# EAGLE design Battlebot_OSMC5 (EAGLE 5.06)
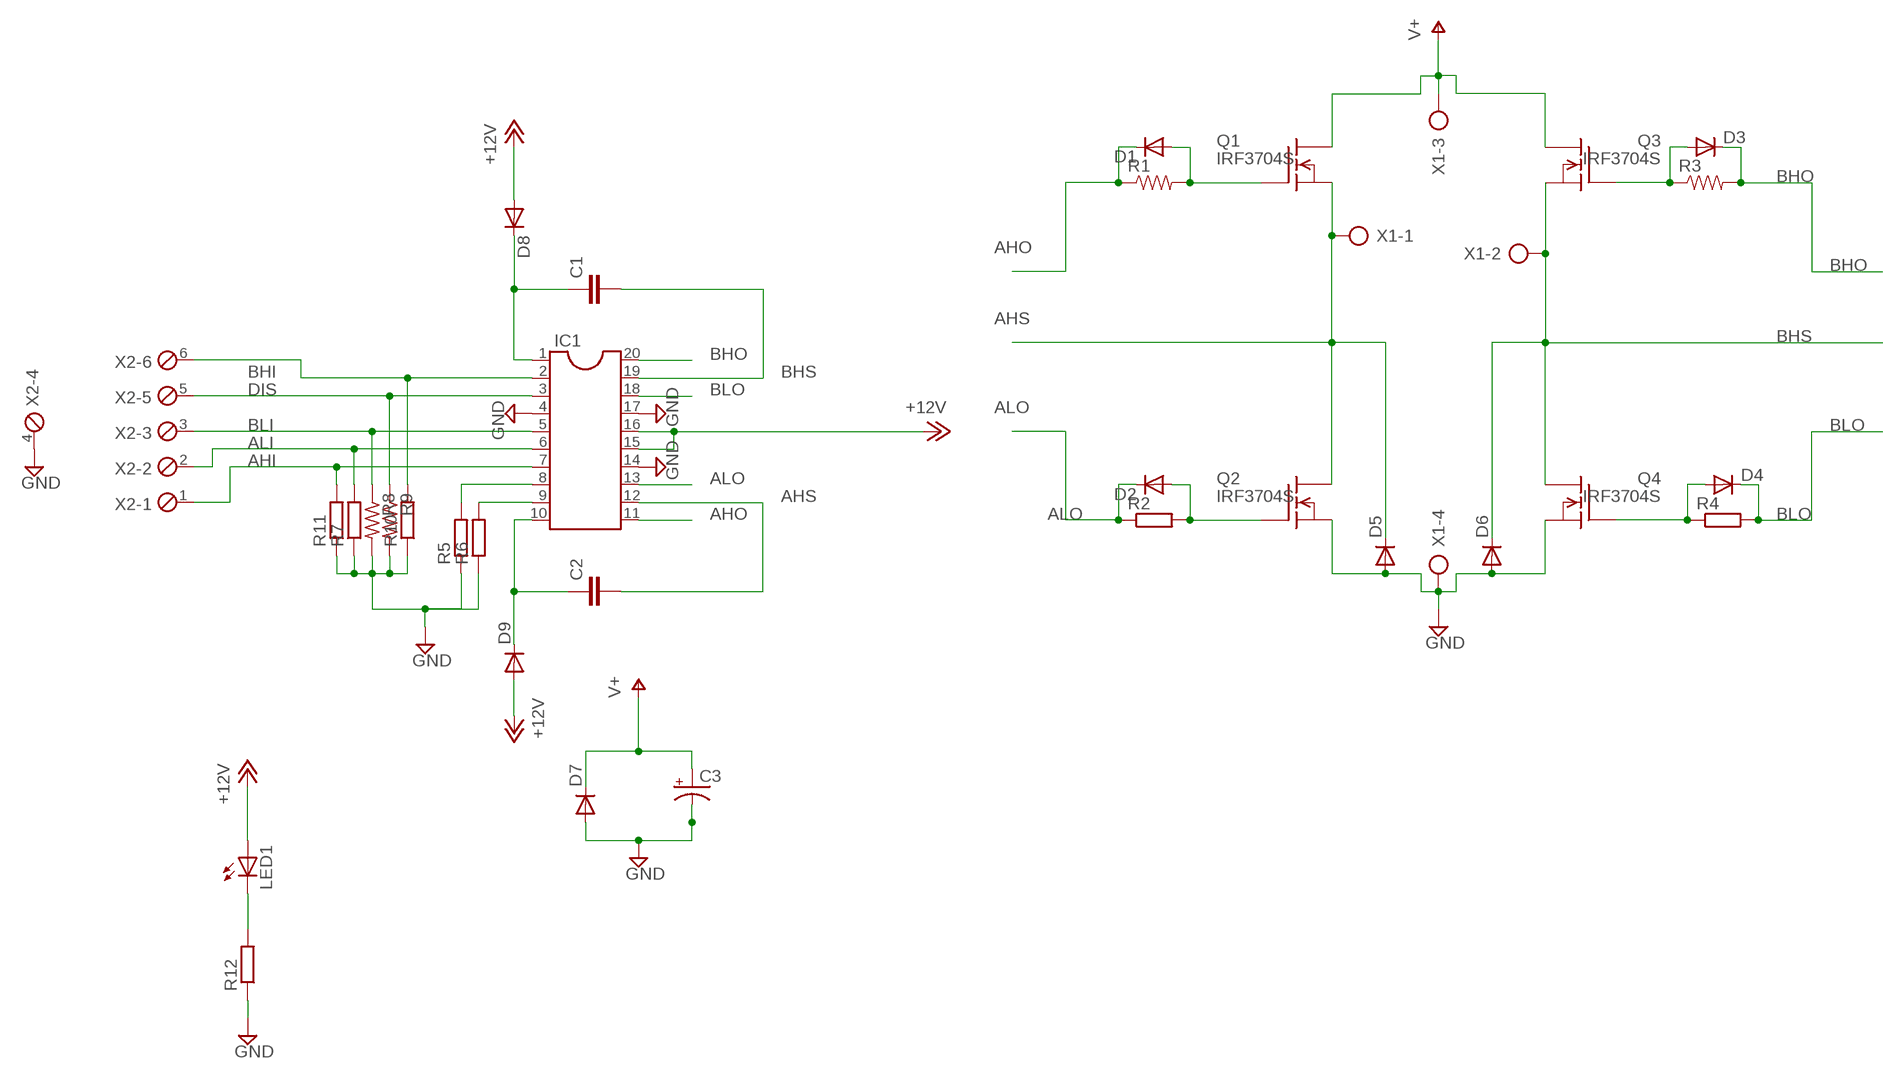
[diagram p0: schematic, sheet 1]

## Parts
C1  C7.5/3  [C7.5B3]
C2  C7.5/3  [C7.5B3]
C3  CPOL-USE5-10.5  [E5-10,5]
D1  DIODE1N4148  [DIODE-1N4148]
D2  DIODE-D-5  [D-5]
D3  DIODE1N4148  [DIODE-1N4148]
D4  DIODE-D-5  [D-5]
D5  DIODE-C1702-05  [C1702-05]
D6  DIODE-C1702-05  [C1702-05]
D7  DIODE-C1702-05  [C1702-05]
D8  1N4148DO35-7  [DO35-7]
D9  1N4148DO35-7  [DO35-7]
IC1  DIL20  [DIL20]
LED1  LED3MM  [LED3MM]
Q1  IRF3704S  BUZ325V  [TO218V]
Q2  IRF3704S  BUZ325V  [TO218V]
Q3  IRF3704S  BUZ325V  [TO218V]
Q4  IRF3704S  BUZ325V  [TO218V]
R1  RESISTORPTH1  [AXIAL-0.3]
R2  R-EU_0204/5  [0204/5]
R3  RESISTORPTH1  [AXIAL-0.3]
R4  R-EU_0204/5  [0204/5]
R5  R-EU_0204/5  [0204/5]
R6  R-EU_0204/5  [0204/5]
R7  R-EU_0204/5  [0204/5]
R8  R-US_0204/2V  [0204V]
R9  R-US_0204/2V  [0204V]
R10  R-EU_0204/5  [0204/5]
R11  R-EU_0204/5  [0204/5]
R12  R-EU_0204/5  [0204/5]
X1  AK500/4  [AK500/4]
X2  MPT6  [6POL254]

## Nets
+12V: D8.A D9.A IC1.15 IC1.16 LED1.A
AHI: IC1.7 R11.2 X2.1
AHO: D1.C IC1.11 R1.P$1
AHS: C2.2 D5.C IC1.12 Q1.3(S) Q2.2(D) X1.1
ALI: IC1.6 R7.2 X2.2
ALO: D2.C IC1.13 R2.1
BHI: IC1.2 R10.2 X2.6
BHO: D3.C IC1.20 R3.P$2
BHS: C1.2 D6.C IC1.19 Q3.3(S) Q4.2(D) X1.2
BLI: IC1.5 R8.1 X2.3
BLO: D4.C IC1.18 R4.2
DIS: IC1.3 R9.1 X2.5
GND: C3.- D5.A D6.A D7.A IC1.4 IC1.14 IC1.17 Q2.3(S) Q4.3(S) R5.1 R6.1 R7.1 R8.2 R9.2 R10.1 R11.1 R12.1 X1.4 X2.4
N$1: C2.1 D9.C IC1.10
N$2: C1.1 D8.C IC1.1
N$5: D1.A Q1.1(G) R1.P$2
N$6: D2.A Q2.1(G) R2.2
N$7: D4.A Q4.1(G) R4.1
N$8: D3.A Q3.1(G) R3.P$1
N$11: LED1.K(C) R12.2
N$14: IC1.8 R5.2
N$15: IC1.9 R6.2
V+: C3.+ D7.C Q1.2(D) Q3.2(D) X1.3

## Library data of the parts
C1 C2 = capacitor-wima:C: CAPACITOR naming: grid - package width
C3 = rcl:CPOL-US: POLARIZED CAPACITOR, American symbol
D1 D3 = SparkFun:DIODE: Diode These are standard reverse protection diodes and small signal diodes. SMA package can handle up to about 1A. SOD-323 can handle about 200mA. What the SOD-323 package when ordering, there are some mfgs out there that are 5-pin packages.
D2 D4-D7 = diode:DIODE-: DIODE
D8 D9 = diode:1N4148: DIODE high speed (Philips)
IC1 = ic-package:DIL20: Dual In Line / Socket
LED1 = SparkFun:LED: LEDs Standard schematic elements and footprints for 5mm, 3mm, 1206, and 0603 sized LEDs. 5mm - Spark Fun Electronics SKU : COM-00529 (and others)
Q1-Q4 = transistor-fet:BUZ325: N-Channel Enhancement MOSFET 400V; 10,5A; 0,5Ohm
R1 R3 = SparkFun:RESISTOR: Resistor Basic schematic elements and footprints for 0603, 1206, and PTH 1/10th watt (small) resistors.
R2 R4-R7 R10-R12 = rcl:R-EU_: RESISTOR, European symbol
R8 R9 = rcl:R-US_: RESISTOR, American symbol
X1 = con-ptr500:AK500/4: CONNECTOR
X2 = con-phoenix-254:MPT6: PHOENIX CONNECTOR

## Board
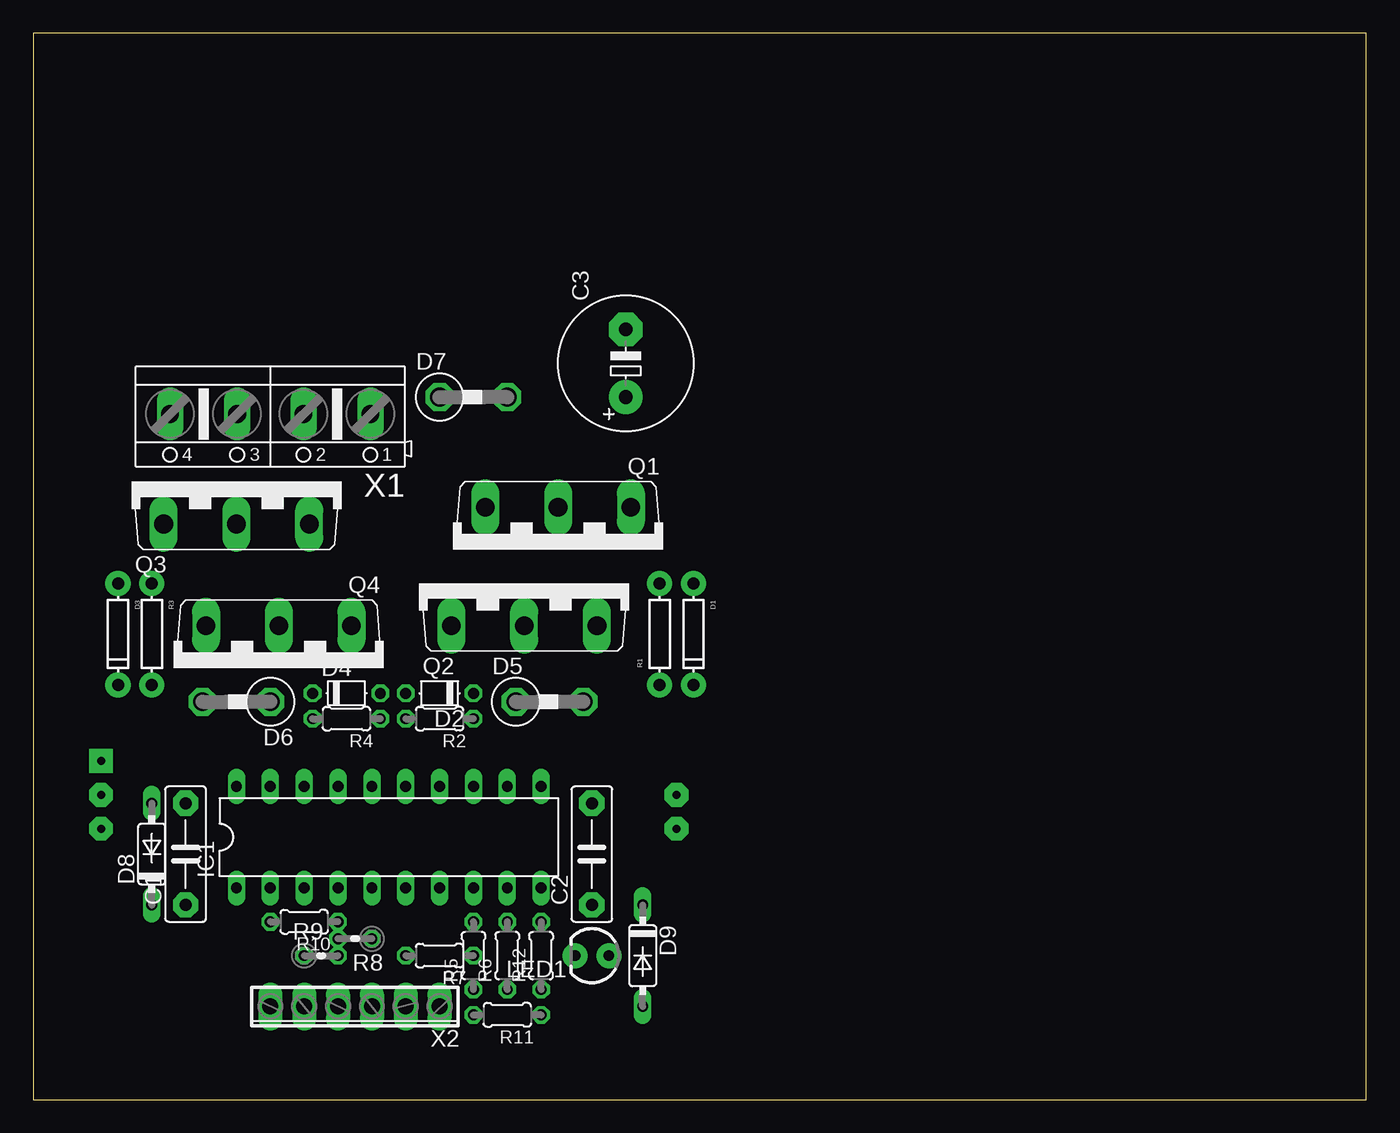
[diagram p1: board, top side]
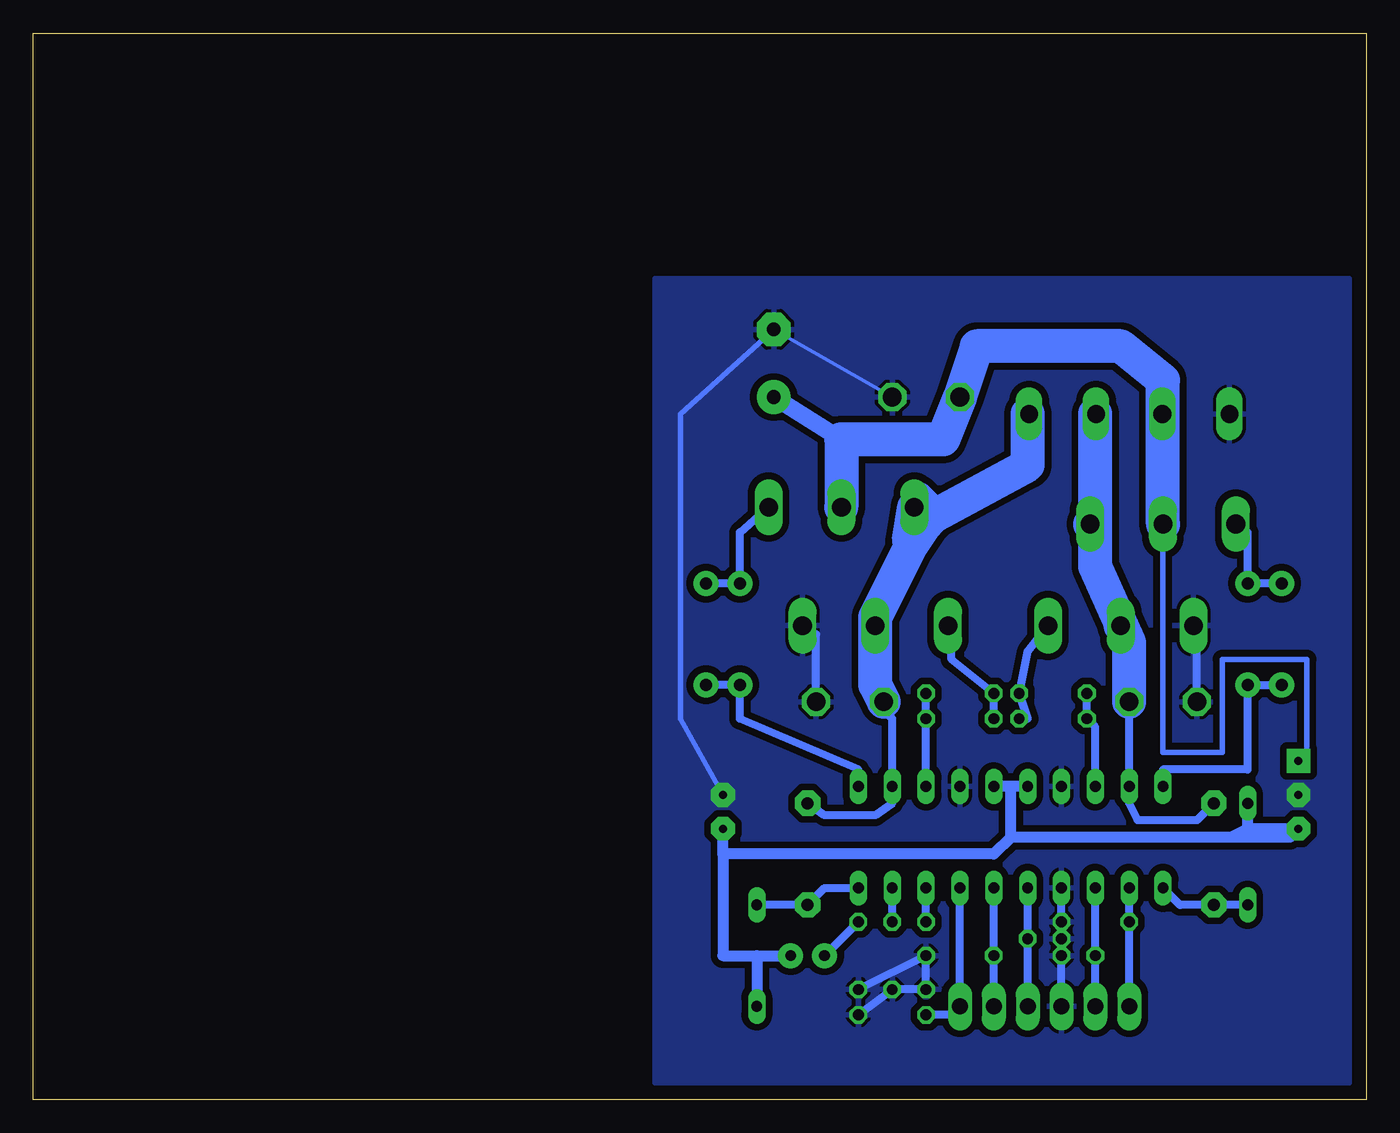
[diagram p2: board, bottom side, seen from below]

Size 100 x 80 mm. Coordinates in mm from the lower left corner, seen from the top.
Outline: 0,0 100,0 100,80 0,80 0,0
Copper layers (1*16): Top 0.035mm / dielectric 1.5mm / Bottom 0.035mm
Design rules "default *": minimum track width 10mil, minimum drill 24mil, track to track 20mil, track to pad 20mil, pad to pad 8mil, via to via 8mil, smd to smd 8mil, copper to edge 40mil, drill to drill 8mil, minimum pad ring 10mil, minimum via ring 8mil, stop-mask expansion 4mil, vias tented up to drill 0mil, thermal gap 10mil

### Footprints (pad centres in the part's own frame; a part is rotated, then mirrored left to right if it is on the bottom)
C7.5B3 = drill 0.914 pad 1.905 octagon: 1 -3.81,0; 2 3.81,0
E5-10,5 = drill 1.016 pad 2.54 round: + -2.54,0 | drill 1.016 pad 2.54 octagon: - 2.54,0
DIODE-1N4148 = drill 0.9 pad 1.88 round: A -3.81,0; C 3.81,0
D-5 = drill 0.813 octagon: A 2.54,0; C -2.54,0
C1702-05 = drill 1.397 octagon: A 2.54,0; C -2.54,0
DO35-7 = drill 0.813 long: A 3.81,0; C -3.81,0
DIL20 = drill 0.813 long: 1 -11.43,-3.81; 2 -8.89,-3.81; 3 -6.35,-3.81; 4 -3.81,-3.81; 5 -1.27,-3.81; 6 1.27,-3.81; 7 3.81,-3.81; 8 6.35,-3.81; 9 8.89,-3.81; 10 11.43,-3.81; 11 11.43,3.81; 12 8.89,3.81; 13 6.35,3.81; 14 3.81,3.81; 15 1.27,3.81; 16 -1.27,3.81; 17 -3.81,3.81; 18 -6.35,3.81; 19 -8.89,3.81; 20 -11.43,3.81
LED3MM = drill 0.813 pad 1.88 round: A -1.27,0; K 1.27,0
TO218V = drill 1.397 long: 1 -5.461,-3.175; 2 0,-3.175; 3 5.461,-3.175
AXIAL-0.3 = drill 0.9 pad 1.88 round: P$1 -3.81,0; P$2 3.81,0
0204/5 = drill 0.813 octagon: 1 -2.54,0; 2 2.54,0
0204V = drill 0.813 octagon: 1 -1.27,0; 2 1.27,0
AK500/4 = drill 1.321 long: 1 -7.518,0; 2 -2.489,0; 3 2.489,0; 4 7.518,0
6POL254 = drill 1.2 pad 1.778 long: 1 -6.35,0; 2 -3.81,0; 3 -1.27,0; 4 1.27,0; 5 3.81,0; 6 6.35,0

### Placement (x,y rotation side)
C1  11.43,18.41 90 top
C2  41.91,18.41 90 top
C3  44.45,55.24 90 top
D1  49.53,34.92 270 top
D2  30.48,30.48 180 top
D3  6.35,34.92 270 top
D4  23.5,30.48 0 top
D5  38.73,29.84 0 top
D6  15.24,29.84 180 top
D7  33.02,52.7 0 top
D8  8.89,18.41 90 top
D9  45.72,10.79 270 top
IC1  26.67,19.68 0 top
LED1  41.91,10.79 180 top
Q1  39.37,41.27 180 top
Q2  36.83,38.73 0 top
Q3  15.24,46.35 0 top
Q4  18.41,32.38 180 top
R1  46.99,34.92 90 top
R2  30.48,28.57 180 top
R3  8.89,34.92 270 top
R4  23.5,28.57 180 top
R5  33.02,10.79 90 top
R6  35.56,10.79 90 top
R7  30.48,10.79 180 top
R8  24.13,12.06 180 top
R9  21.59,10.79 0 top
R10  20.32,13.34 180 top
R11  35.56,6.35 180 top
R12  38.1,10.79 90 top
X1  17.78,51.44 180 top
X2  24.13,6.99 180 top

### Tracks (layer width: path | path; a pad name or v marks a point on that pad's centre or on a via)
+12V  (via drill 0.6 pad 1.78)
  Bottom 0.61: 26.67,23.5 IC1.16 | 48.26,10.79 45.72,10.79
  Bottom 0.813: 10.16,19.68 26.67,19.68 | 26.67,19.68 26.67,23.5 | IC1.16 IC1.15 | 45.72,10.79 D9.A | 26.67,19.68 27.94,18.41 48.26,18.41 | 48.26,18.41 v48.26,20.32 | 48.26,18.41 48.26,10.79 LED1.A | 8.89,19.68 5.71,19.68 v5.08,20.32 8.89,20.32 | 8.89,19.68 8.89,20.32 | 8.89,19.68 D8.A | 8.89,20.32 10.16,19.68 | 8.89,19.68 10.16,19.68
AHI
  Bottom 0.61: R11.2 31.11,6.35 30.48,6.35 X2.1 IC1.7
AHO
  Bottom 0.61: IC1.11 38.1,24.77 46.99,28.57 R1.P$1 D1.C
AHS
  Bottom 0.254: 25.4,51.44 X1.1
  Bottom 0.61: D5.C 36.2,29.21 35.56,28.57 IC1.12 35.56,22.23 36.83,21.34 40.64,21.34 C2.2
  Bottom 2.54: D5.C 36.83,31.11 Q2.2 36.83,36.2 34.29,41.27 33.02,43.18 32.38,43.81 | 34.29,41.91 33.66,45.09 32.38,43.81 | 32.38,43.81 25.4,47.62 25.4,51.44 | 32.38,43.81 34.29,41.91 | 34.29,41.91 Q1.3
ALI
  Bottom 0.61: IC1.6 R7.2 X2.2
ALO
  Bottom 0.61: IC1.13 R2.1 D2.C
BHI
  Bottom 0.61: IC1.2 R10.2 X2.6
BHO
  Bottom 0.61: IC1.20 15.24,24.77 8.89,24.77 R3.P$2 | R3.P$2 D3.C R3.P$2
BHS
  Bottom 0.254: 20.32,51.44 X1.2
  Bottom 0.61: IC1.19 D6.C IC1.19 | C1.2 12.7,20.95 17.14,20.95 17.78,22.23 IC1.19
  Bottom 2.54: 20.32,42.55 20.32,51.44 | 20.32,42.55 Q3.3 | 20.32,42.55 20.32,40.01 17.78,34.29 | 17.78,34.29 Q4.2 | D6.C 17.78,34.29
BLI
  Bottom 0.61: IC1.5 R8.1 X2.3
BLO
  Bottom 0.61: IC1.18 20.32,27.94 R4.2 D4.C
DIS
  Bottom 0.61: X2.5 R9.1 IC1.3
GND  (via drill 0.6 pad 1.78)
  Bottom 0.254: C3.- D7.A | 41.27,34.92 Q2.3 | 12.7,36.2 Q4.3
  Bottom 0.406: v48.26,22.86 51.44,28.57 51.44,51.44 C3.-
  Bottom 0.61: R11.1 R6.1 R5.1 R7.1 R12.1 | IC1.4 R10.1 R8.2 R9.2 X2.4 | D5.A 41.27,34.92 | D6.A 12.7,36.2
  other vias: 5.08,22.86
  pour Bottom: 1.27,61.59 1.27,1.27 53.34,1.27 53.34,61.59
N$1
  Bottom 0.61: IC1.10 40.64,15.88 C2.1 D9.C
N$2
  Bottom 0.61: D8.C C1.1 13.97,14.61 IC1.1
N$5
  Bottom 0.254: R1.P$2 D1.A
  Bottom 0.61: D1.A R1.P$2 46.99,42.55 Q1.1
N$6
  Bottom 0.61: R2.2 D2.A 31.11,33.02 31.11,35.56 Q2.1
N$7
  Bottom 0.61: R4.1 25.4,28.57 D4.A 25.4,33.66 Q4.1
N$8
  Bottom 0.61: D3.A R3.P$1 8.89,42.55 10.16,42.55 Q3.1
N$11
  Bottom 0.61: R12.2 LED1.K
N$14
  Bottom 0.61: R5.2 IC1.8
N$15
  Bottom 0.61: R6.2 IC1.9
V+  (via drill 0.6 pad 1.78)
  Bottom 0.254: 15.24,53.98 X1.3
  Bottom 0.406: v5.08,25.4 4.45,25.4 4.45,33.02 10.79,33.02 10.79,26.04 15.24,26.04 Q3.2
  Bottom 1.27: 39.37,49.53 C3.+
  Bottom 2.54: Q1.2 39.37,49.53 31.75,49.53 D7.C 29.21,56.52 18.41,56.52 15.24,53.98 Q3.2